# Altium schematic sheet RP2040_Evaluation_Design.SchDoc: RP2040 Evaluation Board
size B; Date: 6/27/2021; Author: Robert Pafford; Organization: ORGANIZATION; Address1: ADDRESS 1; Address2: ADDRESS 2; Address3: ADDRESS 3; Address4: ADDRESS 4; Revision: -; SheetNumber: 1; SheetTotal: 3; ENG_APP_DATE: --/--/--; DSN_APP_DATE: --/--/--; CHK_APP_DATE: --/--/--
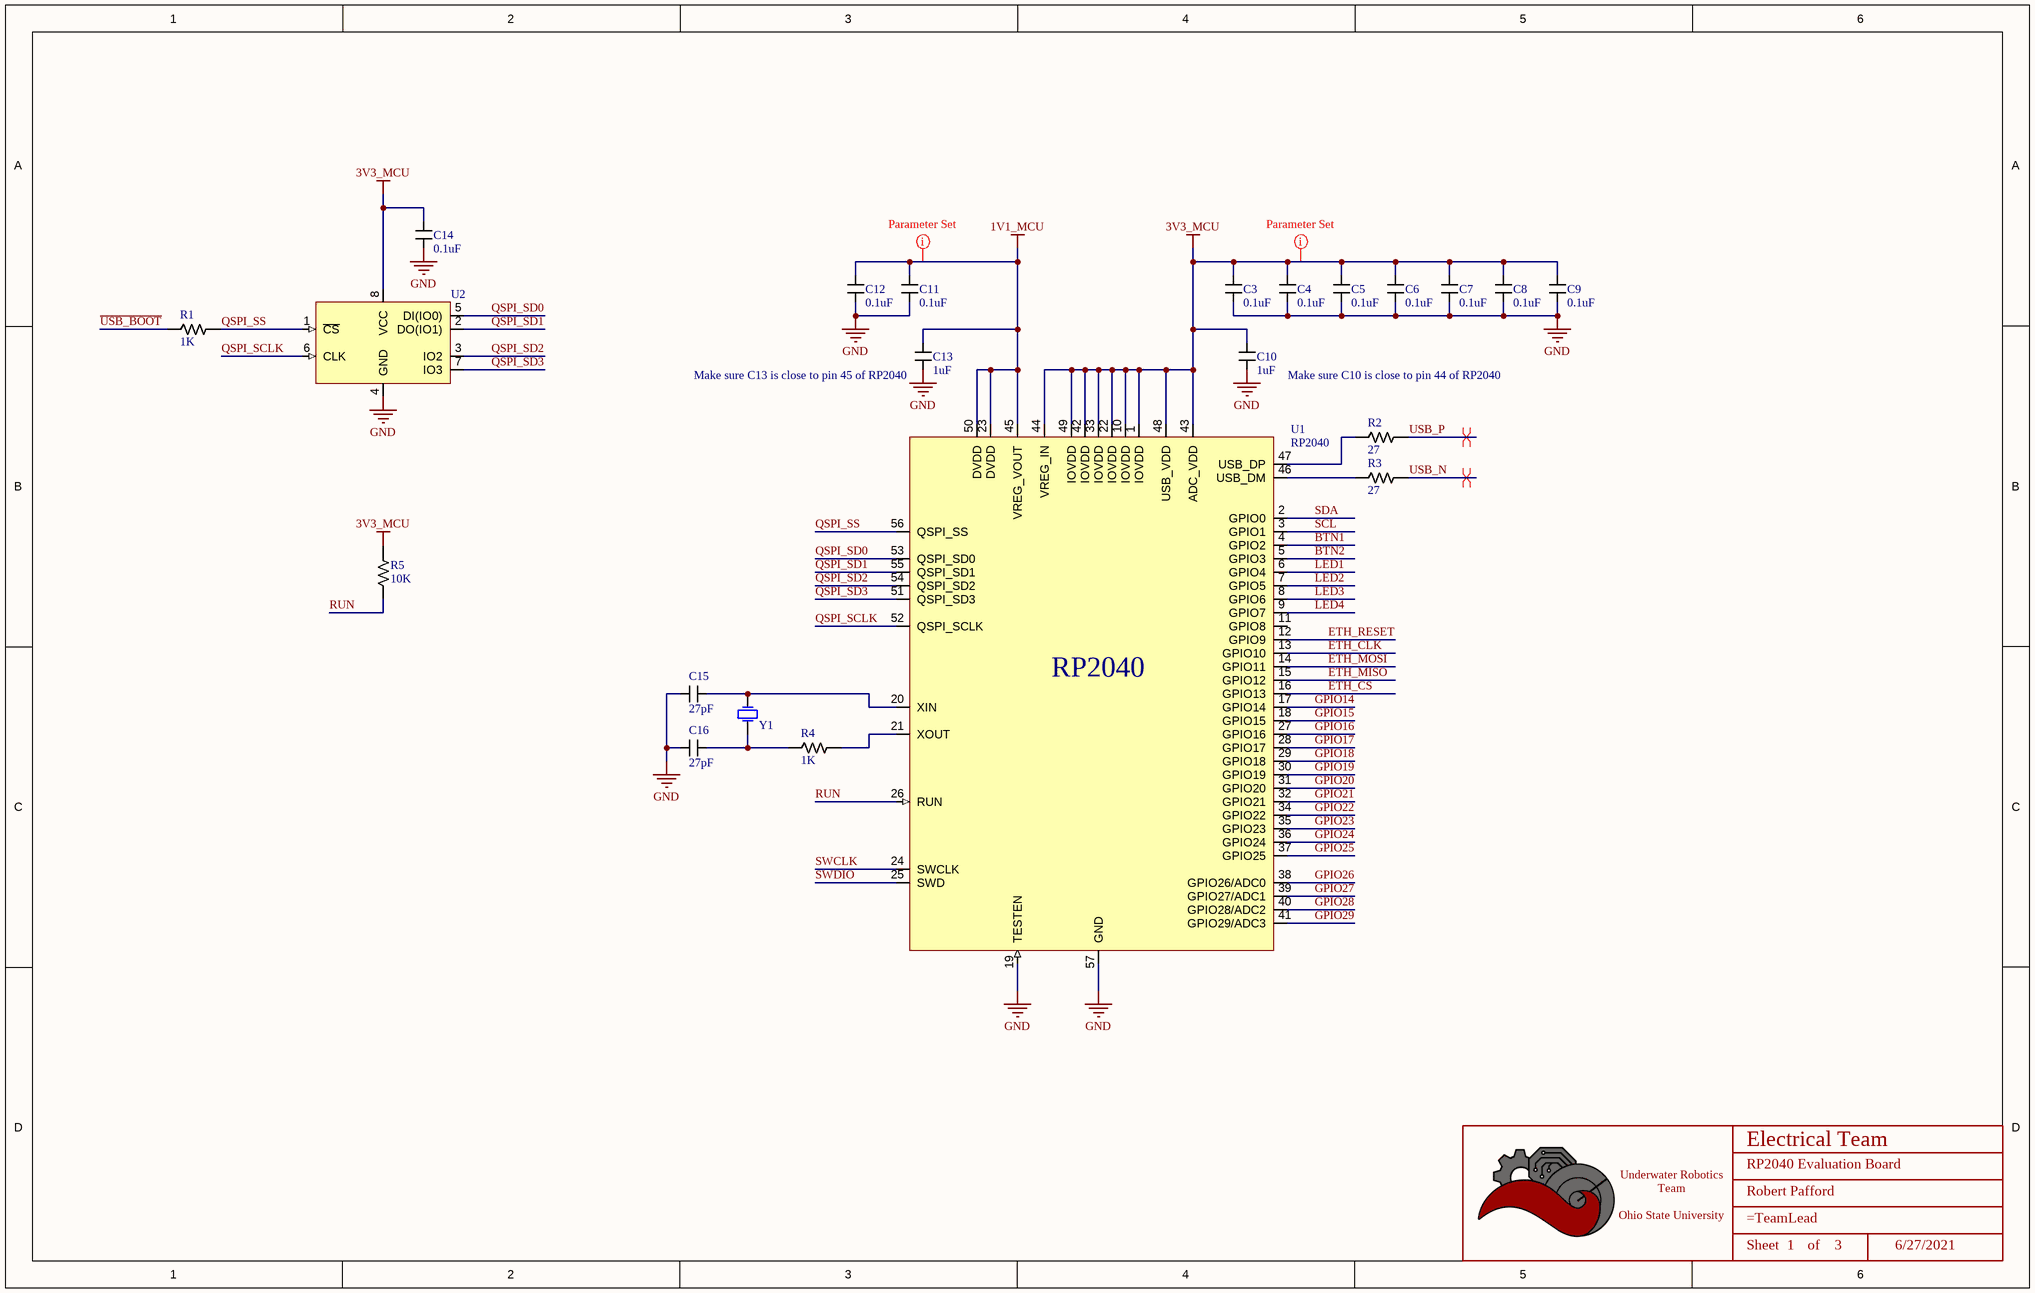
[diagram p0: RP2040_Evaluation_Design.SchDoc]

## Parts
*  Title_Block  (value not drawn)  (graphical)
C3  value 0.1uF  [CAPACITOR_0603]  (hidden comment: 100nF Ceramic 6.3V)
C4  value 0.1uF  [CAPACITOR_0603]  (hidden comment: 100nF Ceramic 6.3V)
C5  value 0.1uF  [CAPACITOR_0603]  (hidden comment: 100nF Ceramic 6.3V)
C6  value 0.1uF  [CAPACITOR_0603]  (hidden comment: 100nF Ceramic 6.3V)
C7  value 0.1uF  [CAPACITOR_0603]  (hidden comment: 100nF Ceramic 6.3V)
C8  value 0.1uF  [CAPACITOR_0603]  (hidden comment: 100nF Ceramic 6.3V)
C9  value 0.1uF  [CAPACITOR_0603]  (hidden comment: 100nF Ceramic 6.3V)
C10  value 1uF  [CAPACITOR_0603]  (hidden comment: 1uF Ceramic 16V)
C11  value 0.1uF  [CAPACITOR_0603]  (hidden comment: 100nF Ceramic 6.3V)
C12  value 0.1uF  [CAPACITOR_0603]  (hidden comment: 100nF Ceramic 6.3V)
C13  value 1uF  [CAPACITOR_0603]  (hidden comment: 1uF Ceramic 16V)
C14  value 0.1uF  [CAPACITOR_0603]  (hidden comment: 100nF Ceramic 6.3V)
C15  value 27pF  [CAPACITOR_0603]  (hidden comment: 27pF Ceramic 50V)
C16  value 27pF  [CAPACITOR_0603]  (hidden comment: 27pF Ceramic 50V)
R1  Value  (Ohms): 1K  [RESISTOR_0603]  (hidden comment: 1k Ohm 5% 1/8W)
R2  Value  (Ohms): 27  [RESISTOR_0603]  (hidden comment: 27 Ohm 5% 1/8W)
R3  Value  (Ohms): 27  [RESISTOR_0603]  (hidden comment: 27 Ohm 5% 1/8W)
R4  Value  (Ohms): 1K  [RESISTOR_0603]  (hidden comment: 1k Ohm 5% 1/8W)
R5  Value  (Ohms): 10K  [RESISTOR_0603]  (hidden comment: 10k Ohm 5% 1/10W)
U1  RP2040  [QFN-56 RP2040]
U2  W25Q128JVSIQ  [SOIC-8 W25QxJV]  (value not drawn)
Y1  CRYSTAL_12MHZ  [CRYSTAL_THROUGH_HOLE]  (value not drawn)

## Nets
1V1_MCU: C11.1 C12.1 C13.1 U1.23(DVDD) U1.45(VREG_VOUT) U1.50(DVDD)
3V3_MCU: C3.1 C4.1 C5.1 C6.1 C7.1 C8.1 C9.1 C10.1 C14.1 R5.1 U1.1(IOVDD) U1.10(IOVDD) U1.22(IOVDD) U1.33(IOVDD) U1.42(IOVDD) U1.43(ADC_VDD) U1.44(VREG_IN) U1.48(USB_VDD) U1.49(IOVDD) U2.8(VCC)
GND: C3.2 C4.2 C5.2 C6.2 C7.2 C8.2 C9.2 C10.2 C11.2 C12.2 C13.2 C14.2 C15.2 C16.2 U1.19(TESTEN) U1.57(GND) U2.4(GND)
BTN1: U1.4(GPIO2)
BTN2: U1.5(GPIO3)
ETH_CLK: U1.13(GPIO10)
ETH_CS: U1.16(GPIO13)
ETH_MISO: U1.15(GPIO12)
ETH_MOSI: U1.14(GPIO11)
ETH_RESET: U1.12(GPIO9)
GPIO14: U1.17(GPIO14)
GPIO15: U1.18(GPIO15)
GPIO16: U1.27(GPIO16)
GPIO17: U1.28(GPIO17)
GPIO18: U1.29(GPIO18)
GPIO19: U1.30(GPIO19)
GPIO20: U1.31(GPIO20)
GPIO21: U1.32(GPIO21)
GPIO22: U1.34(GPIO22)
GPIO23: U1.35(GPIO23)
GPIO24: U1.36(GPIO24)
GPIO25: U1.37(GPIO25)
GPIO26: U1.38(GPIO26/ADC0)
GPIO27: U1.39(GPIO27/ADC1)
GPIO28: U1.40(GPIO28/ADC2)
GPIO29: U1.41(GPIO29/ADC3)
LED1: U1.6(GPIO4)
LED2: U1.7(GPIO5)
LED3: U1.8(GPIO6)
LED4: U1.9(GPIO7)
QSPI_SCLK: U1.52(QSPI_SCLK) U2.6(CLK)
QSPI_SD0: U1.53(QSPI_SD0) U2.5(DI(IO0))
QSPI_SD1: U1.55(QSPI_SD1) U2.2(DO(IO1))
QSPI_SD2: U1.54(QSPI_SD2) U2.3(IO2)
QSPI_SD3: U1.51(QSPI_SD3) U2.7(IO3)
QSPI_SS: R1.1 U1.56(QSPI_SS) U2.1(~{CS})
RUN: R5.2 U1.26(RUN)
SCL: U1.3(GPIO1)
SDA: U1.2(GPIO0)
SWCLK: U1.24(SWCLK)
SWDIO: U1.25(SWD)
~{USB_BOOT}: R1.2
USB_N: R3.1
USB_P: R2.1
NetC15_1: C15.1 U1.20(XIN) Y1.2
NetC16_1: C16.1 R4.2 Y1.1
NetR2_2: R2.2 U1.47(USB_DP)
NetR3_2: R3.2 U1.46(USB_DM)
NetR4_1: R4.1 U1.21(XOUT)

Not connected (* = marked no-connect by the designer): U1 11(GPIO8)

## Layout directives
differential pair; differential pair class USB 2.0: USB_N, USB_P
rule Supply Nets [Voltage = 1.100]: 1V1_MCU
rule Supply Nets [Voltage = 3.300]: 3V3_MCU

## Notes on the sheet
- (near C13) Make sure C13 is close to pin 45 of RP2040
- Make sure C10 is close to pin 44 of RP2040
- DWG. NO.
- REV.
- SHT.
- THIS DOCUMENT AND THE DATA DISCLOSED HEREIN OR HEREWITH IS THE PROPERTY OF ALTIUM LIMITED AND MAY BE FREELY DISTRIBUTED IN WHOLE. NO RIGHTS ARE RESERVED OR EXPRESS OR IMPLIED WARANTEE GIVEN.
- REVISION
- DESCRIPTION
- DATE
- APPROVED
- ENG:
- APPROVALS
- PROJECT
- DSN:
- CHK:
- REFERENCE DOCUMENTS
- PROJECT REVISION:
- TITLE
- DOCUMENT REVISION:
- DESIGN ITEM:
- BOM:
- FAB DWG:
- PCB DWG:
- ASSY DWG:
- SCALE:
- SIZE
- B
- CAGE CODE
- FILE NAME
- DWG NO.
- SHEET
- OF
- REV
- (in symbol Title_Block) Electrical Team; Underwater Robotics Team / Ohio State University; Sheet; of

## Library data of the parts
* = Title_Block: UWRT Schematic Title Block Template / Created June 2021, Dylan Trainor
C3-C9 C11 C12 C14 = CAPACITOR_0.1uF_0603: Cap 100nF 6.3V +/-10% / Ceramic 0603; Made By: Flip B; ComponentLink1Description: Datsheet; ComponentLink1URL: https://www.mouser.com/datasheet/2/212/KEM_C1002_X7R_SMD-1102033.pdf; Tolerance: +/- 10%; Voltage: 6.3V; Supplier 1: Digi-Key; Supplier Part Number 1: 399-15351-1-ND
C10 C13 = CAPACITOR_1uF_0603: Cap 1uF 16V +/-10% / Ceramic 0603; Made By: Flip B; Tolerance: +/- 10%; Voltage: 16V; Supplier 1: Digi-Key; Supplier Part Number 1: 399-7847-1-ND
C15 C16 = CAPACITOR_0.000027uF_0603: Cap 27pF 50V +/-5% / Ceramic 0603; Made By: Flip B; ComponentLink1Description: Datsheet; ComponentLink1URL: https://www.mouser.com/datasheet/2/212/KEM_C1002_X7R_SMD-1102033.pdf; Tolerance: +/- 5%; Voltage: 50V; Supplier 1: Digi-Key; Supplier Part Number 1: 311-1063-1-ND
R1 R4 = RESISTOR_1K_0603: RES 1k OHM 5% 1/10W 0603; Tolerance: +/- 5%; Made By: Flip B; ComponentLink1Description: Datasheet; ComponentLink1URL: https://www.bourns.com/docs/product-datasheets/CRxxxxx.pdf; Wattage: 1/10W; Supplier: Digikey; Digikey Part Numer: CR0603-JW-104ELFTR-ND; Supplier 1: Digi-Key; Supplier Part Number 1: 2019-RK73B1JTTD102JCT-ND
R2 R3 = RESISTOR_27_0603: RES 27 OHM 5% 1/8W 0603; Tolerance: +/- 5%; Wattage: 1/10W; Made By: Flip B; ComponentLink1Description: Datasheet; ComponentLink1URL: https://www.bourns.com/docs/product-datasheets/CRxxxxx.pdf; Supplier: Digikey; Digikey Part Numer: CR0603-JW-104ELFTR-ND; Supplier 1: Digi-Key; Supplier Part Number 1: 2019-RK73B1JTTD270JCT-ND
R5 = RESISTOR_10K_0603: RES 10k OHM 5% 1/10W 0603; Tolerance: +/- 5%; Wattage: 1/8W; Made By: Robert Pafford; ComponentLink1Description: Datasheet; ComponentLink1URL: https://www.bourns.com/docs/product-datasheets/CRxxxxx.pdf; Supplier: Digikey; Digikey Part Numer: CR0603-JW-104ELFTR-ND; Supplier 1: Digi-Key; Supplier Part Number 1: 2019-RK73B1JTTD103JCT-ND
U1 = RP2040: Raspberry Pi RP2040; ComponentLink1Description: DigiKey; ComponentLink1URL: *
U2 = W25Q128JVSIQ: IC FLASH 128MBIT SPI/QUAD 8SOIC; Supplier 1: Digi-Key; Supplier Part Number 1: W25Q128JVSIQ-ND
Y1 = CRYSTAL_12MHZ: CRYSTAL 12.0000MHZ 18PF TH; Supplier 1: Digi-Key; Supplier Part Number 1: 50-ECS-120-18-4X-CKM-ND